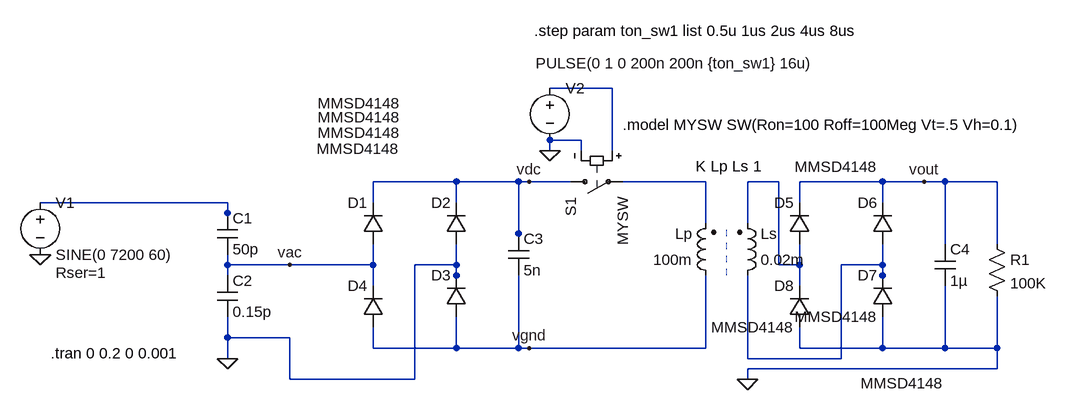
[diagram p0: schematic circuit2.asc]
circuit2.asc, the LTspice schematic file:
Version 4
SHEET 1 1680 680
WIRE 992 -16 896 -16
WIRE 944 64 896 64
WIRE 896 80 896 64
WIRE 944 80 944 64
WIRE 992 80 992 -16
WIRE 752 128 624 128
WIRE 848 128 752 128
WIRE 864 128 848 128
WIRE 928 128 864 128
WIRE 1136 128 1008 128
WIRE 1248 128 1200 128
WIRE 1408 128 1280 128
WIRE 1472 128 1408 128
WIRE 1504 128 1472 128
WIRE 1584 128 1504 128
WIRE 400 160 112 160
WIRE 624 160 624 128
WIRE 752 160 752 128
WIRE 1280 160 1280 128
WIRE 1408 160 1408 128
WIRE 400 176 400 160
WIRE 400 192 400 176
WIRE 1136 192 1136 128
WIRE 1200 192 1200 128
WIRE 848 208 848 128
WIRE 848 224 848 208
WIRE 1504 224 1504 128
WIRE 1584 224 1584 128
WIRE 400 256 400 240
WIRE 496 256 400 256
WIRE 624 256 624 224
WIRE 624 256 496 256
WIRE 752 256 752 224
WIRE 752 256 688 256
WIRE 1248 256 1248 128
WIRE 1280 256 1280 224
WIRE 1280 256 1248 256
WIRE 1408 256 1408 224
WIRE 1408 256 1344 256
WIRE 400 272 400 256
WIRE 752 272 752 256
WIRE 1408 272 1408 256
WIRE 624 288 624 256
WIRE 752 288 752 272
WIRE 1280 288 1280 256
WIRE 1408 288 1408 272
WIRE 400 368 400 336
WIRE 496 368 400 368
WIRE 624 384 624 352
WIRE 752 384 752 336
WIRE 752 384 624 384
WIRE 848 384 848 272
WIRE 848 384 752 384
WIRE 864 384 848 384
WIRE 1136 384 1136 272
WIRE 1136 384 864 384
WIRE 1280 384 1280 352
WIRE 1408 384 1408 336
WIRE 1408 384 1280 384
WIRE 1504 384 1504 288
WIRE 1504 384 1408 384
WIRE 1584 384 1584 304
WIRE 1584 384 1504 384
WIRE 400 400 400 368
WIRE 1200 400 1200 272
WIRE 1344 400 1344 256
WIRE 1344 400 1200 400
WIRE 1584 416 1584 384
WIRE 1584 416 1200 416
WIRE 496 432 496 368
WIRE 688 432 688 256
WIRE 688 432 496 432
WIRE 1200 432 1200 416
FLAG 112 240 0
FLAG 400 400 0
FLAG 864 128 vdc
FLAG 864 384 vgnd
FLAG 496 256 vac
FLAG 896 80 0
FLAG 1472 128 vout
FLAG 1200 432 0
SYMBOL voltage 112 144 R0
WINDOW 123 0 0 Left 0
WINDOW 39 24 124 Left 2
SYMATTR SpiceLine Rser=1
SYMATTR InstName V1
SYMATTR Value SINE(0 7200 60)
SYMBOL cap 384 176 R0
SYMATTR InstName C1
SYMATTR Value 50p
SYMBOL cap 384 272 R0
SYMATTR InstName C2
SYMATTR Value 0.15p
SYMBOL cap 832 208 R0
SYMATTR InstName C3
SYMATTR Value 5n
SYMBOL ind2 1152 288 R180
WINDOW 0 36 80 Left 2
WINDOW 3 36 40 Left 2
SYMATTR InstName Lp
SYMATTR Value 100m
SYMATTR Type ind
SYMATTR SpiceLine Rser=3
SYMBOL ind2 1184 288 M180
WINDOW 0 36 80 Left 2
WINDOW 3 36 40 Left 2
SYMATTR InstName Ls
SYMATTR Value 0.02m
SYMATTR Type ind
SYMATTR SpiceLine Rser=0.2
SYMBOL res 1568 208 R0
SYMATTR InstName R1
SYMATTR Value 100K
SYMBOL sw 912 128 M90
SYMATTR InstName S1
SYMATTR Value MYSW
SYMBOL voltage 896 -32 R0
WINDOW 123 0 0 Left 0
WINDOW 39 0 0 Left 0
WINDOW 3 -22 -22 Left 2
SYMATTR Value PULSE(0 1 0 200n 200n {ton_sw1} 16u)
SYMATTR InstName V2
SYMBOL cap 1488 224 R0
SYMATTR InstName C4
SYMATTR Value 1µ
SYMBOL diode 640 224 R180
WINDOW 0 24 64 Left 2
WINDOW 3 -26 171 Left 2
SYMATTR InstName D1
SYMATTR Value MMSD4148
SYMBOL diode 768 224 R180
WINDOW 0 24 64 Left 2
WINDOW 3 103 147 Left 2
SYMATTR InstName D2
SYMATTR Value MMSD4148
SYMBOL diode 768 336 R180
WINDOW 0 24 64 Left 2
WINDOW 3 102 307 Left 2
SYMATTR InstName D3
SYMATTR Value MMSD4148
SYMBOL diode 640 352 R180
WINDOW 0 24 64 Left 2
WINDOW 3 -26 345 Left 2
SYMATTR InstName D4
SYMATTR Value MMSD4148
SYMBOL diode 1296 224 R180
WINDOW 0 24 64 Left 2
WINDOW 3 -104 119 Left 2
SYMATTR InstName D5
SYMATTR Value MMSD4148
SYMBOL diode 1424 224 R180
WINDOW 0 24 64 Left 2
WINDOW 3 -78 -214 Left 2
SYMATTR InstName D6
SYMATTR Value MMSD4148
SYMBOL diode 1424 336 R180
WINDOW 0 24 64 Left 2
WINDOW 3 24 0 Left 2
SYMATTR InstName D7
SYMATTR Value MMSD4148
SYMBOL diode 1296 352 R180
WINDOW 0 24 64 Left 2
WINDOW 3 24 0 Left 2
SYMATTR InstName D8
SYMATTR Value MMSD4148
TEXT 128 392 Left 2 !.tran 0 0.2 0 0.001
TEXT 1120 104 Left 2 !K Lp Ls 1
TEXT 1008 40 Left 2 !.model MYSW SW(Ron=100 Roff=100Meg Vt=.5 Vh=0.1)
TEXT 872 -104 Left 2 !.step param ton_sw1 list 0.5u 1us 2us 4us 8us
LINE Normal 1168 272 1168 192 2

The netlist it stands for:
* circuit2.asc
V1 N004 0 SINE(0 7200 60) Rser=1
C1 N004 vac 50p
C2 vac 0 0.15p
C3 vdc vgnd 5n
Lp vgnd N002 100m Rser=3
Ls N005 N003 0.02m Rser=0.2
R1 vout 0 100K
S1 vdc N002 N001 0 MYSW
V2 N001 0 PULSE(0 1 0 200n 200n {ton_sw1} 16u)
C4 vout 0 1µ
D1 vac vdc MMSD4148
D2 0 vdc MMSD4148
D3 vgnd 0 MMSD4148
D4 vgnd vac MMSD4148
D5 N003 vout MMSD4148
D6 N005 vout MMSD4148
D7 0 N005 MMSD4148
D8 0 N003 MMSD4148
.model D D
.lib standard.dio
.tran 0 0.2 0 0.001
K Lp Ls 1
.model MYSW SW(Ron=100 Roff=100Meg Vt=.5 Vh=0.1)
.step param ton_sw1 list 0.5u 1us 2us 4us 8us
.backanno
.end